# Altium schematic sheet Power.SchDoc
size A; SheetNumber: 1; SheetTotal: 5
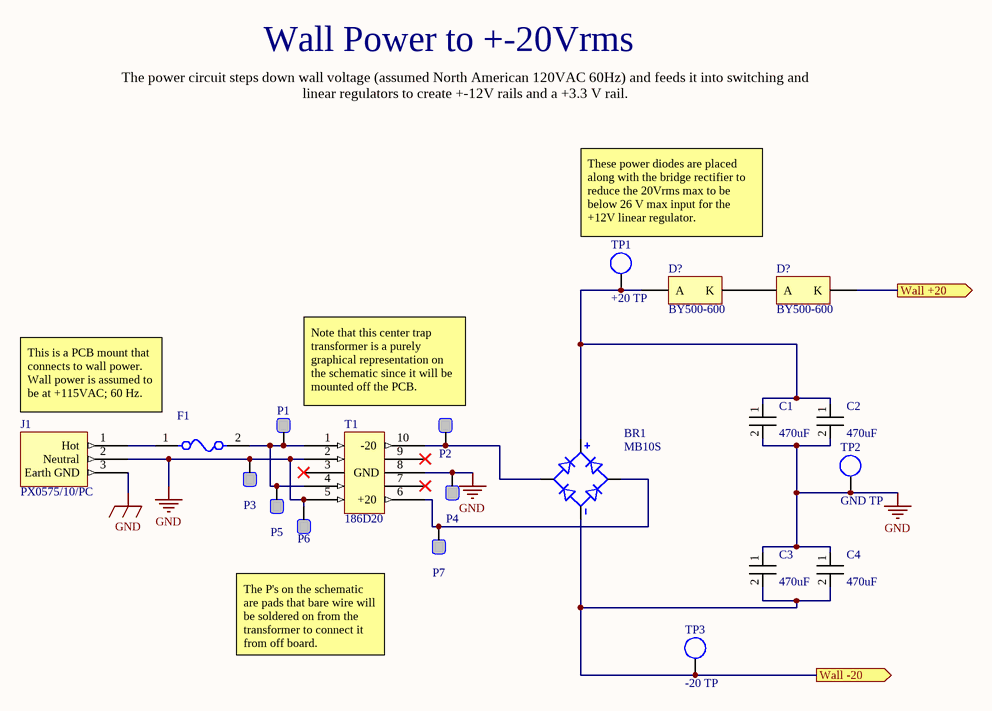
[diagram p0: Power.SchDoc]

## Parts
(Parts that share a designator on the sheet are numbered #1, #2 ... from top to bottom, then left to right.)
BR1  MB10S  [SOIC245P670X290-4N]
C1  470uF  [PCBComponent_1]
C2  470uF  [PCBComponent_1]
C3  470uF  [PCBComponent_1]
C4  470uF  [PCBComponent_1]
D?#1  BY500-600  [ONSC-AXIAL_LEAD-2-267-05_V]
D?#2  BY500-600  [ONSC-AXIAL_LEAD-2-267-05_V]
F1  C1F 3  [FP-0466-MFG]  (value not drawn)
J1  PX0575/10/PC  [PCBComponent_1]
P1  Pad  [Pad-Footprint-1]  (value not drawn)
P2  Pad  [Pad-Footprint-1]  (value not drawn)
P3  Pad  [Pad-Footprint-1]  (value not drawn)
P4  Pad  [Pad-Footprint-1]  (value not drawn)
P5  Pad  [Pad-Footprint-1]  (value not drawn)
P6  Pad  [Pad-Footprint-1]  (value not drawn)
P7  Pad  [Pad-Footprint-1]  (value not drawn)
T1  186D20
TP1  +20 TP  [PCBComponent_1]
TP2  GND TP  [PCBComponent_1]
TP3  -20 TP  [PCBComponent_1]

## Ports
Wall +20 (out), Wall -20 (out)

## Nets
GND: C1.2(-) C2.2(-) C3.1(+) C4.1(+) J1.2(Neutral) J1.3(Earth_GND) P3.P P4.P P6.P T1.2 T1.5 T1.8(GND) TP2.TP
Wall +20: D?#2.1(K) ; port Wall +20
Wall -20: BR1.2(NEG) C3.2(-) C4.2(-) TP3.TP ; port Wall -20
NetBR1_1: BR1.1(POS) C1.1(+) C2.1(+) D?#1.2(A) TP1.TP
NetBR1_3: BR1.3(AC2) P2.P T1.10(-20)
NetBR1_4: BR1.4(AC1) P7.P T1.6(+20)
NetD?#1_1: D?#1.1(K) D?#2.2(A)
NetF1_1: F1.1 J1.1(Hot)
NetF1_2: F1.2 P1.P P5.P T1.1 T1.4

Not connected (* = marked no-connect by the designer): T1 3* 7* 9*

## Notes on the sheet
- Wall Power to +-20Vrms
- The power circuit steps down wall voltage (assumed North American 120VAC 60Hz) and feeds it into switching and linear regulators to create +-12V rails and a +3.3 V rail.
- These power diodes are placed along with the bridge rectifier to reduce the 20Vrms max to be below 26 V max input for the +12V linear regulator.
- This is a PCB mount that connects to wall power.  Wall power is assumed to be at +115VAC; 60 Hz.
- Note that this center trap transformer is a purely graphical representation on the schematic since it will be mounted off the PCB.
- The P's on the schematic are pads that bare wire will be soldered on from the transformer to connect it from off board.

## Library data of the parts
BR1 = MB10S: Bridge Rectifier Single Phase Standard 1kV Surface Mount 4-SOIC; MF: ON Semiconductor; MP: MB10S; Package: SOIC-4 ON Semiconductor; Digi-Key_Purchase_URL: https://www.digikey.com/product-detail/en/on-semiconductor/MB10S/MB10SCT-ND/2444921?utm_source=snapeda&utm_medium=aggregator&utm_campaign=symbol; Digi-Key_Part_Number: MB10SCT-ND; SnapEDA_Link: https://www.snapeda.com/parts/MB10S/ON%20Semiconductor/view-part/1686091/?ref=snap; Value: *
C1-C4 = UPS1H471MPD-3: 470uF Joe Knows Electronics Capacitor Footprint.   13x20 mm diameter and length, Leads are 0.6mm, 5mm dist between leads, 4mm from edge
D?#1 D?#2 = CMP-1055-00010-1: Rectifier, 2-Pin Axial_Lead, Pb-Free, Tape and Reel; Manufacturer: On Semiconductor; PartNumber: 1N5822RLG; Configuration: Single; IFSM Max (A): 80; ComponentLink2URL: http://www.onsemi.cn/pub_link/Collateral/1N5820-D.PDF; Packing: Tape and Reel; ComponentLink1Description: Manufacturer URL; PackageDescription: 2-Pin, Axial Lead, Diameter 5.05 mm; ComponentLink3Description: Package Specification; PackageReference: AXIAL_LEAD-2-267-05; PackageVersion: Rev. G, 06/2000; ComponentLink1URL: http://www.onsemi.com/; ComponentLink2Description: Datasheet; RoHS: TRUE; Mounting Technology: Through Hole; DatasheetVersion: Rev. 10; ComponentLink3URL: http://www.onsemi.com/pub_link/Collateral/267-05.PDF
F1 = CMP-08605-000081-1: FUSE BOARD MNT 200MA 125VAC/VDC; Body Material: Thermoplastic; Voltage Rating: 125V; Fuse Type: Board Mount (Cartridge Style Excluded); Resistance: 1.15R; Approvals: UL; DC Cold Resistance: 1.16R; Case Code (Metric): 3216; Depth: 1.52mm; Case/Package: 1206; Lead Free: Lead Free; Length: 3.18mm; Max Operating Temperature: 90°C; Case Code (Imperial): 1206; Terminal Material: Copper; Radiation Hardening: No; Working Voltage: 125V; Packaging: Tape and Reel; Width: 0.06inch; Housing Material: Ceramic; Voltage Rating (AC): 125V; Current Rating: 200mA; Fuse Current: 200mA; Package Quantity: 5000; Height: 0.023inch; Termination: SMD/SMT; Voltage Rating (DC): 125V; Mount: Surface Mount; Min Operating Temperature: -55°C; Number of Pins: 2
J1 = CMP-002-00071-3: Conn Inlet M 3 POS 9.17mm Solder RA Thru-Hole 3 Terminal 1 Port Bulk
P1-P7 = CMP-002-00072-3: For soldering bare wire onto
T1 = CMP-012-00000-1: Power Transformer 2000Vrms 30VA 7 Terminal Solder Lug/Quick Connect Flange Mount; ComponentLink1URL: https://www.hammfg.com/files/parts/pdf/186D20.pdf; Name: 186D20; ComponentLink1Description: connection sheet
TP1-TP3 = Component_1